# EAGLE design RFM12B-V1.1 (EAGLE 6.4)
ABBREV: rf1; PROJECT: RFM12B Board
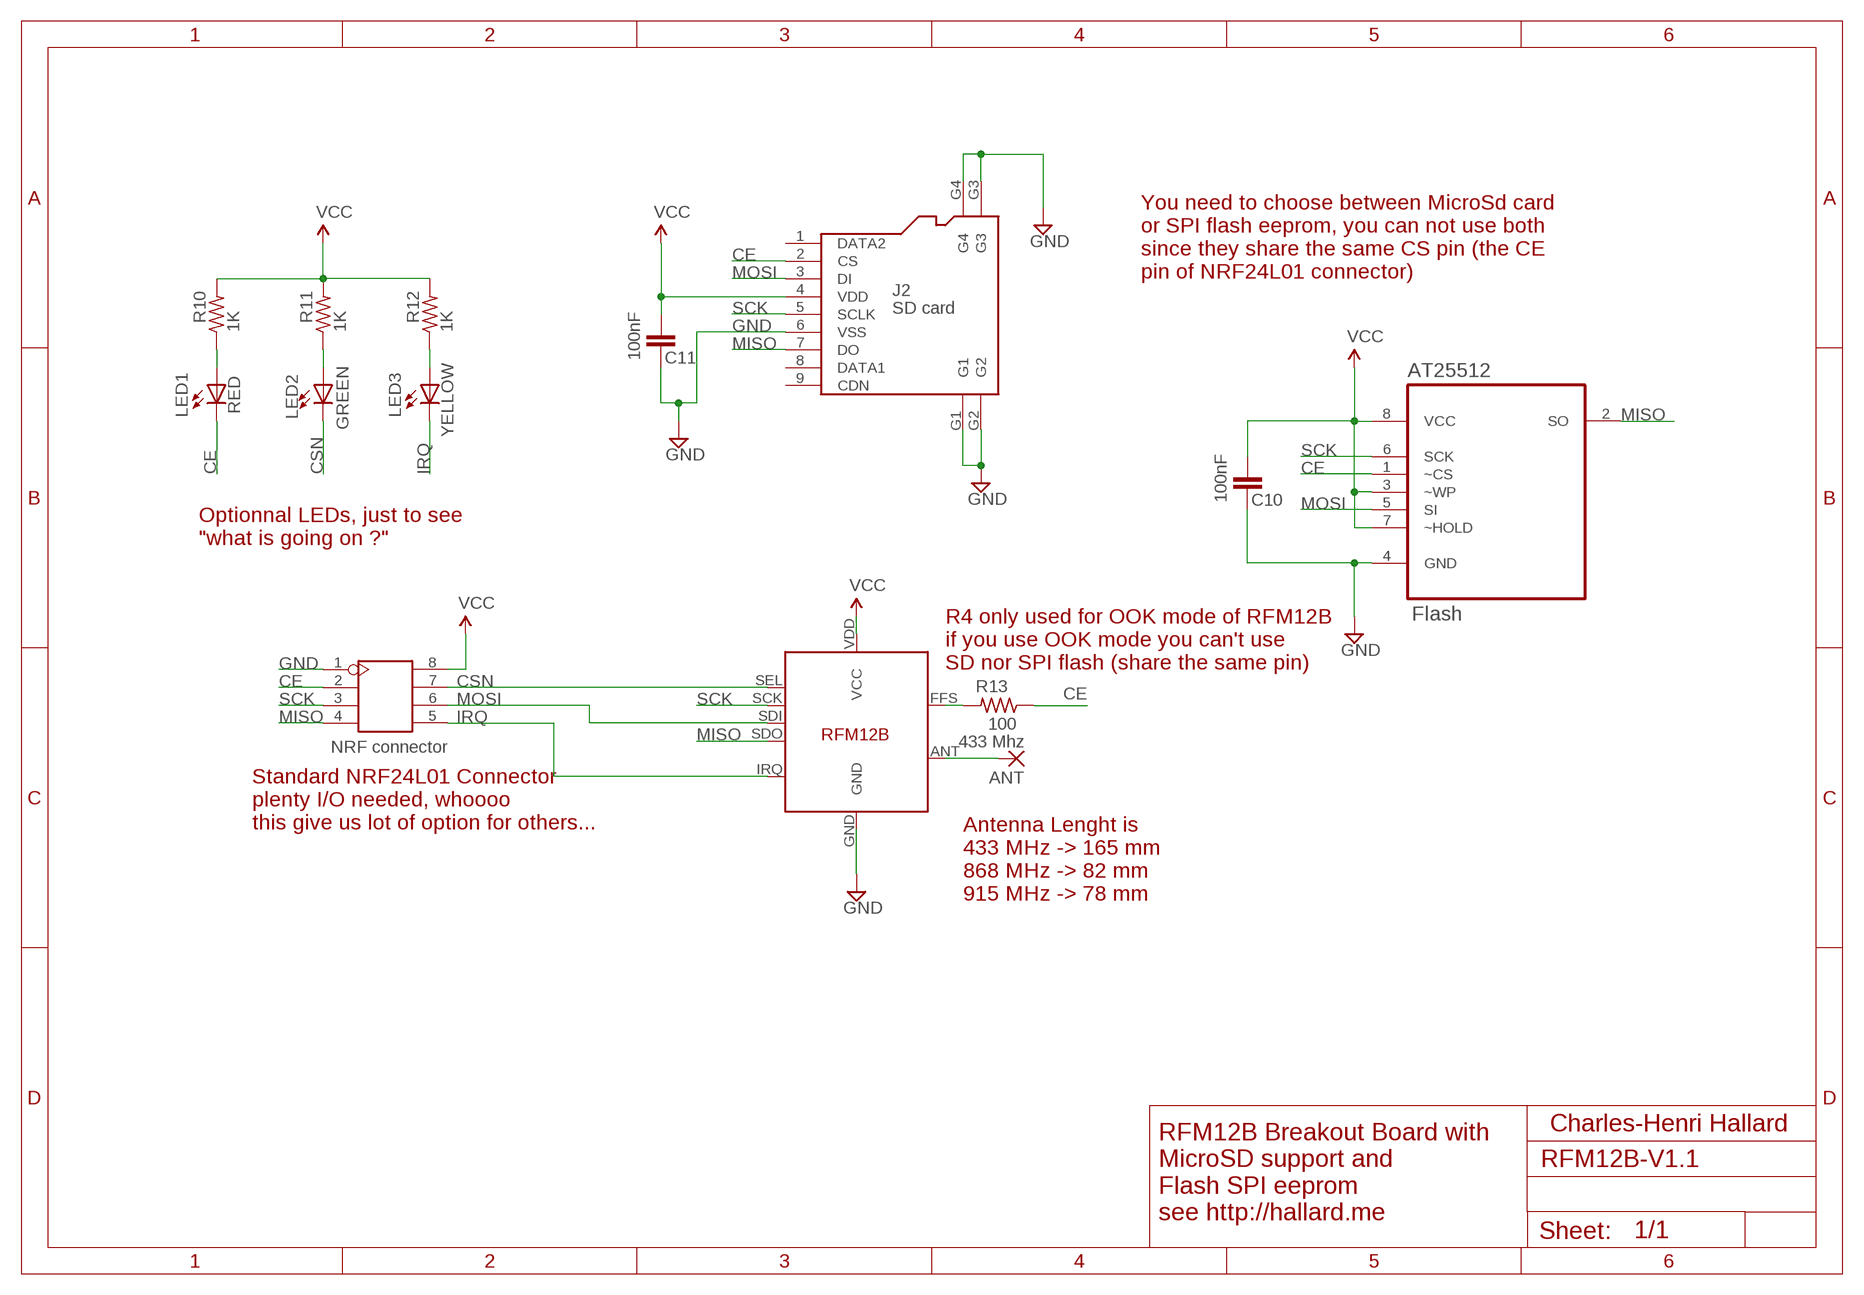
[diagram p0: schematic, sheet 1]

## Parts
ANT  433 Mhz  1,6/0,8  [1,6/0,8]
AT25512  Flash  AT25512N-SH-B  [SOIC127P600X175-8N]
C10  100nF  C-EUC0805  [C0805]
C11  100nF  C-EUC0805  [C0805]
J1  NRF connector  HEADER-2X4P-2.54  [2X4P-2.54]
J2  SD card  HOLDER-MICROSD-9P  [9P-SMD-W/-RING]
LED1  RED  LED-0805  [LED-805]
LED2  GREEN  LED-0805  [LED-805]
LED3  YELLOW  LED-0805  [LED-805]
R10  1K  R-US_M0805  [M0805]
R11  1K  R-US_M0805  [M0805]
R12  1K  R-US_M0805  [M0805]
R13  100  R-US_M0805  [M0805]
U$2  RFM12B  [RFM12B]

## Nets
CE: AT25512.1(~CS) J1.2 J2.2(CS) LED1.C R13.1
CSN: J1.7 LED2.C U$2.SEL
GND [power]: AT25512.4(GND) C10.2 C11.2 J1.1 J2.6(VSS) J2.G1 J2.G2 J2.G3 J2.G4 U$2.GND
IRQ: J1.5 LED3.C U$2.IRQ
MISO: AT25512.2(SO) J1.4 J2.7(DO) U$2.SDO
MOSI: AT25512.5(SI) J1.6 J2.3(DI) U$2.SDI
N$1: ANT.1(P) U$2.ANT
N$2: LED1.A R10.1
N$3: LED2.A R11.1
N$5: LED3.A R12.1
N$6: R13.2 U$2.FFS
SCK: AT25512.6(SCK) J1.3 J2.5(SCLK) U$2.SCK
VCC [power]: AT25512.3(~WP) AT25512.7(~HOLD) AT25512.8(VCC) C10.1 C11.1 J1.8 J2.4(VDD) R10.2 R11.2 R12.2 U$2.VDD(VCC)
Unconnected: J2.1(DATA2) J2.8(DATA1) J2.9(CDN)

## Notes on the sheet
- You need to choose between MicroSd card
  or SPI flash eeprom, you can not use both
  since they share the same CS pin (the CE
  pin of NRF24L01 connector)
- Optionnal LEDs, just to see
  "what is going on ?"
- R4 only used for OOK mode of RFM12B
  if you use OOK mode you can't use 
  SD nor SPI flash (share the same pin)
- Standard NRF24L01 Connector
  plenty I/O needed, whoooo
  this give us lot of option for others...
- Antenna Lenght is
  433 MHz -> 165 mm
  868 MHz -> 82 mm
  915 MHz -> 78 mm
- Charles-Henri Hallard
- RFM12B Breakout Board with
  MicroSD support and
  Flash SPI eeprom
  see http://hallard.me

## Library data of the parts
ANT = JeeLabs:1,6/0,8: THROUGH-HOLE PAD
AT25512 = Atmel_By_element14_Batch_1:AT25512N-SH-B: SPI Serial EEPROM; MPN: AT25512N-SH-B; OC_FARNELL: 1841581; OC_NEWARK: 12T1360; PACKAGE: SOIC-8; SUPPLIER: Atmel
C10 C11 = resistor:C-EU: CAPACITOR, European symbol
J1 = Seeed-Connector:HEADER-2X4P
J2 = Connector:HOLDER-MICROSD-9P
LED1-LED3 = dp_devices:LED: Light Emitting Diode
R10-R13 = resistor:R-US_: RESISTOR, American symbol
U$2 = lh-library:RFM12B

## Net classes
1 power: width 0.203 mm, drill 0.305 mm, clearance 0.152 mm

## Board
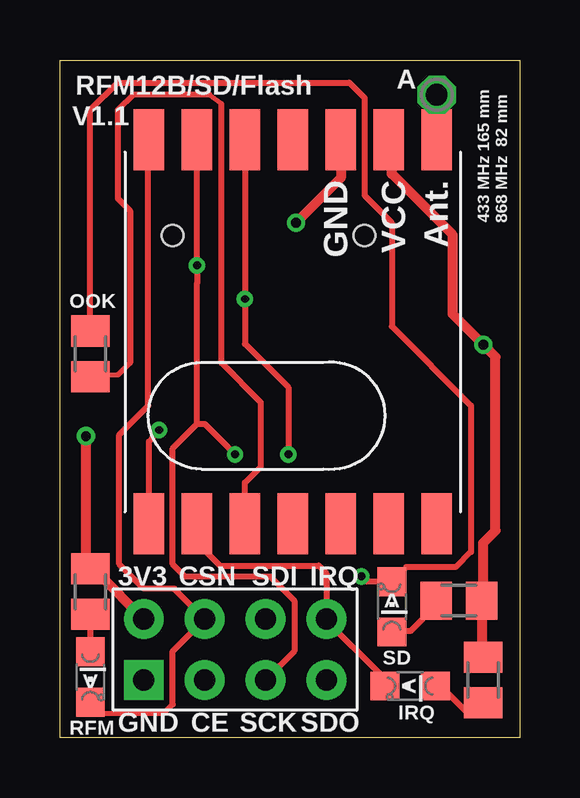
[diagram p1: board, top side]
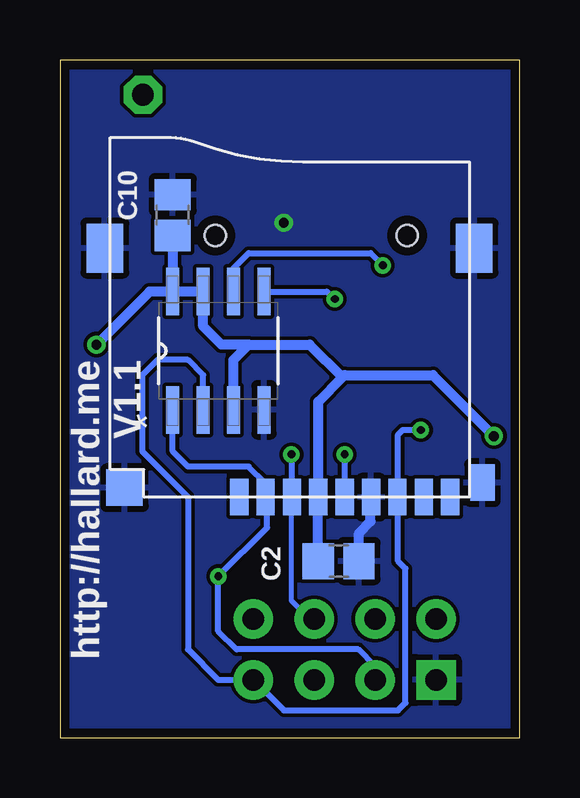
[diagram p2: board, bottom side, seen from below]

Size 19.18 x 28.24 mm. Coordinates in mm from the lower left corner, seen from the top.
Outline: 0,0 0,28.25 19.18,28.25 19.18,0 0,0
Copper layers (1*16): Top 0.0356mm / dielectric 1.5011mm / Bottom 0.0356mm
Design rules "oshpark": minimum track width 6mil, minimum drill 13mil, track to track 6mil, track to pad 6mil, pad to pad 6mil, via to via 6mil, smd to smd 6mil, copper to edge 15mil, drill to drill 6mil, minimum pad ring 7mil, minimum via ring 7mil, stop-mask expansion 3mil, vias tented up to drill 0mil, thermal gap 10mil

### Footprints (pad centres in the part's own frame; a part is rotated, then mirrored left to right if it is on the bottom)
1,6/0,8 = drill 0.9 pad 1.6 octagon: 1 0,0
SOIC127P600X175-8N = smd 1.981 x 0.559: 1 -2.464,1.905; 2 -2.464,0.635; 3 -2.464,-0.635; 4 -2.464,-1.905; 5 2.464,-1.905; 6 2.464,-0.635; 7 2.464,0.635; 8 2.464,1.905
C0805 = smd 1.3 x 1.5: 1 -0.85,0; 2 0.85,0
2X4P-2.54 = drill 0.889 pad 1.651 square: 1 -1.27,3.81 | drill 0.889 pad 1.651: 2 -1.27,1.27; 3 -1.27,-1.27; 4 -1.27,-3.81; 5 1.27,-3.81; 6 1.27,-1.27; 7 1.27,1.27; 8 1.27,3.81
9P-SMD-W/-RING = smd 1.524 x 0.762: 1 0,4.4; 2 0,3.3; 3 0,2.2; 4 0,1.1; 5 0,0; 6 0,-1.1; 7 0,-2.2; 8 0,-3.3; 9 0,-4.4 | smd 1.524 x 1.016: G1 0.6,-5.746 | smd 2.032 x 1.524: G2 10.373,-5.4; G3 10.373,10 | smd 1.524 x 1.524: G4 0.392,9.181 | hole 0.889: 10.9,-2.6; 10.9,5.4
LED-805 = smd 1.2 x 1.2: A 0,-1.05; C 0,1.05
M0805 = smd 1.3 x 1.6: 1 -0.95,0; 2 0.95,0
RFM12B = smd 2.54 x 1.27: ANT 8,-6; FFS -8,2; GND 8,-2; IRQ -8,4; P$8 -8,0; P$9 -8,-2; P$10 -8,-4; P$12 -8,-6; P$16 8,0; SCK 8,4; SDI 8,2; SDO -8,6; SEL 8,6; VDD 8,-4

### Placement (x,y rotation side)
ANT  15.71,26.8 0 top
AT25512  12.57,16.13 90 bottom
C10  14.48,21.78 90 bottom
C11  7.56,7.37 0 bottom
J1  7.3,3.68 90 top
J2  7.3,10.03 90 bottom
LED1  13.84,5.46 0 top
LED2  1.27,2.54 180 top
LED3  14.6,2.16 90 top
R10  16.64,5.71 0 top
R11  1.27,6.1 90 top
R12  17.65,2.41 90 top
R13  1.27,16 270 top
U$2  9.72,16.92 90 top

### Tracks (layer width: path | path; a pad name or v marks a point on that pad's centre or on a via)
CE  (via drill 0.33)
  Top 0.203: 14.44,7.11 LED1.C
  Top 0.254: LED1.C 12.79,6.51 v12.57,6.73 | R13.1 1.27,26.16 2.41,27.3 12.06,27.3 12.7,26.67 12.7,22.61 13.84,21.46 13.84,17.14 17.14,13.84 17.14,7.75 16.51,7.11 14.44,7.11
  Bottom 0.203: 10.54,9.97 J2.2 10.6,10.6
  Bottom 0.254: 10.54,9.97 10.54,8.76 v12.57,6.73 12.57,4.45 11.81,3.68 6.73,3.68 6.03,2.98 J1.2 | 10.6,10.6 11.3,11.3 13.84,11.3 14.48,11.94 AT25512.1
CSN
  Top 0.203: 4.7,1.4 4.32,1.02 1.78,1.02 1.3,1.49 LED2.C | 3.68,24.88 U$2.SEL
  Top 0.254: 4.7,1.4 4.7,3.62 J1.7 4.76,6.22 3.49,6.22 2.48,7.24 2.48,12.64 3.68,13.84 3.68,24.88
GND  (via drill 0.41)
  Top 0.381: U$2.GND 11.71,25.55
  Top 0.406: U$2.GND 11.71,23.34 v9.84,21.46
  Bottom 0.203: 5.97,9.52 5.97,9.8 J2.6
  Bottom 0.406: C11.2 6.71,8.53 6.22,9.02 6.22,10.01 J2.6
  pour Bottom: 0.06,0.06 0.06,28.18 18.99,28.18 18.99,0.06
IRQ
  Top 0.203: U$2.IRQ 5.72,8.13 | J1.5 11.11,4.89 | 13.33,2.67 13.33,2.38 LED3.C
  Top 0.254: 5.72,8.13 6.67,7.18 10.79,7.18 11.11,6.86 J1.5 | 11.11,4.89 13.33,2.67
MISO  (via drill 0.33)
  Top 0.254: U$2.SDO 3.71,12.35 v4.13,12.83
  Bottom 0.203: 5.08,10.01 J2.7
  Bottom 0.254: v4.13,12.83 4.89,12.83 5.08,12.64 5.08,10.01 5.08,7.37 4.76,7.05 4.76,1.46 5.08,1.14 9.84,1.14 J1.4 12.57,2.41 13.84,3.68 13.84,10.03 15.75,11.94 15.75,15.11 15.11,15.75 13.84,15.75 13.21,15.11 AT25512.2
MOSI  (via drill 0.33)
  Top 0.254: U$2.SDI v7.72,18.29 7.72,16.41 9.52,14.6 v9.52,11.81
  Bottom 0.203: J1.6 8.57,4.76 9.52,5.71 9.52,10.01 J2.3 9.52,10.05
  Bottom 0.254: v9.52,11.81 9.52,10.05 | AT25512.5 8.05,18.59 v7.72,18.29
N$1
  Top 0.203: U$2.ANT 15.71,25.69
  Top 0.254: ANT.1 15.71,25.69
N$2
  Top 0.203: R10.1 15.69,5.53 | 13.88,4.45 LED1.A
  Top 0.254: 15.69,5.53 14.6,4.45 13.88,4.45
N$3
  Top 0.254: R11.1 LED2.A
N$5
  Top 0.203: LED3.A 15.87,2.16 | 16.89,1.14 17.33,1.14 R12.1
  Top 0.254: 15.87,2.16 16.89,1.14
N$6
  Top 0.203: 6.73,26.42 6.22,26.8 | 2.92,15.62 2.41,15.11 1.2,15.11 R13.2
  Top 0.254: U$2.FFS 7.72,10.64 8.38,11.3 8.38,13.97 6.73,15.62 6.73,26.42 | 6.22,26.8 3.05,26.8 2.41,26.16 2.41,22.48 2.92,21.97 2.92,15.62
SCK  (via drill 0.33)
  Top 0.254: 5.72,13.08 5.72,18.92 v5.72,19.69 U$2.SCK | J1.3 9.78,3.62 9.78,5.71 8.76,6.73 5.21,6.73 4.7,7.24 4.7,12.06 5.72,13.08 | 5.72,13.08 6.03,13.08 v7.3,11.81
  Bottom 0.203: AT25512.6 11.94,19.56 | 6.22,20.19
  Bottom 0.254: v7.3,11.81 J2.5 | 11.94,19.56 11.3,20.19 6.22,20.19 v5.72,19.69
VCC  (via drill 0.41)
  Top 0.203: R11.2 1.14,7.05 1.59,7.49
  Top 0.381: 13.71,25.74 U$2.VDD
  Top 0.406: 1.59,7.49 1.59,6.86 J1.8 | U$2.VDD 13.84,24.79 13.84,23.5 16.38,20.96 16.38,17.65 v17.65,16.38 18.16,15.87 18.16,8.64 17.65,8.13 17.65,5.78 R10.2 17.59,3.43 R12.2 | v1.08,12.57 1.08,7.11 R11.2
  Bottom 0.406: 7.4,15.02 8.4,14.01 J2.4 C11.1 | 7.4,15.02 7.3,15.11 3.62,15.11 v1.08,12.57 | AT25512.8 AT25512.7 13.21,17.14 12.45,16.38 11.3,16.38 | AT25512.8 15.44,18.59 v17.65,16.38 | AT25512.3 11.94,15.75 11.3,16.38 | 11.3,16.38 8.76,16.38 7.4,15.02 | C10.1 AT25512.8

### Text on the board
tNames: RFM12B/SD/Flash | A | V1.1 | GND | VCC | Ant. | 433 MHz 165 mm / 868 MHz 82 mm | OOK | 3V3 | CSN | SDI | IRQ | |> | SD | <| | <| | IRQ | RFM | GND | CE | SCK | SDO
bNames: http://hallard.me / V1.1 | C2